# Altium schematic sheet Power-Tree-Main.SchDoc
size A3; DocumentNumber: 4-; SheetNumber: 4; SheetTotal: 7
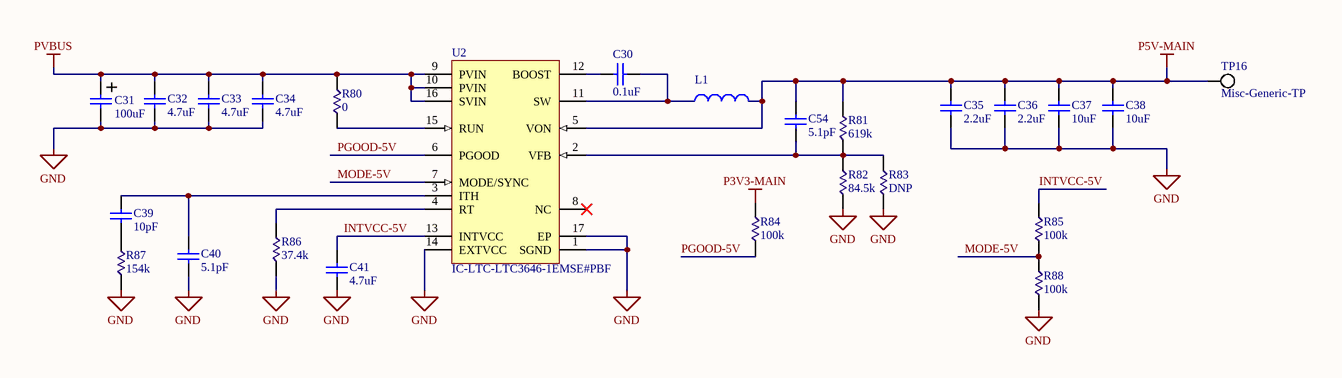
[diagram p0: Power-Tree-Main.SchDoc]

## Parts
C30  value 0.1uF  [FOOTPRINT-0805-GEN]  (hidden comment: Capacitor-Generic-0805)
C31  value 100uF  [FOOTPRINT-NIPPON-JA0]  (hidden comment: Capacitor-Nippon-HHXC350ARA470MF80G)
C32  value 4.7uF  [FOOTPRINT-1206-GEN]  (hidden comment: C1206C475K5RACAUTO)
C33  value 4.7uF  [FOOTPRINT-1206-GEN]  (hidden comment: C1206C475K5RACAUTO)
C34  value 4.7uF  [FOOTPRINT-1206-GEN]  (hidden comment: C1206C475K5RACAUTO)
C35  value 2.2uF  [FOOTPRINT-0805-GEN]  (hidden comment: C0805C225K8PAC)
C36  value 2.2uF  [FOOTPRINT-0805-GEN]  (hidden comment: C0805C225K8PAC)
C37  value 10uF  [FOOTPRINT-0805-GEN]  (hidden comment: C0805C106K8PAC)
C38  value 10uF  [FOOTPRINT-0805-GEN]  (hidden comment: C0805C106K8PAC)
C39  value 10pF  [FOOTPRINT-0805-GEN]  (hidden comment: C0805C100J3HACTU)
C40  value 5.1pF  [FOOTPRINT-0805-GEN]  (hidden comment: C0805C519K5GACTU)
C41  value 4.7uF  [FOOTPRINT-0805-GEN]  (hidden comment: C0805C475K8PAC)
C54  value 5.1pF  [FOOTPRINT-0805-GEN]  (hidden comment: C0805C519K5GACTU)
L1  Inductor-Bourns-SRP7050TA-2R2M  [FOOTPRINT-BOURNS-SRP7050TA]  (value not drawn)
R80  value 0  [FOOTPRINT-0805-GEN]  (hidden comment: SMC)
R81  value 619k  [FOOTPRINT-0805-GEN]  (hidden comment: SMC)
R82  value 84.5k  [FOOTPRINT-0805-GEN]  (hidden comment: SMC)
R83  value DNP  [FOOTPRINT-0805-GEN]  (hidden comment: Trim, 0 ohm)
R84  value 100k  [FOOTPRINT-0805-GEN]  (hidden comment: SMC)
R85  value 100k  [FOOTPRINT-0805-GEN]  (hidden comment: SMC)
R86  value 37.4k  [FOOTPRINT-0805-GEN]  (hidden comment: SMC)
R87  value 154k  [FOOTPRINT-0805-GEN]  (hidden comment: SMC)
R88  value 100k  [FOOTPRINT-0805-GEN]  (hidden comment: SMC)
TP16  Misc-Generic-TP  [FOOTPRINT-GENERIC-TP-VIA-1MM5]
U2  IC-LTC-LTC3646-1EMSE#PBF  [FOOTPRINT-LTC-LTC3646]

## Nets
GND: C31.2 C32.1 C33.1 C34.1 C35.2 C36.2 C37.1 C38.1 C40.1 C41.1 R82.2 R83.2 R86.1 R87.1 R88.1 U2.1(SGND) U2.14(EXTVCC) U2.17(EP)
P3V3-MAIN: R84.2
P5V-MAIN: C35.1 C36.1 C37.2 C38.2 C54.2 L1.2 R81.2 TP16.1(TP) U2.5(VON)
PVBUS: C31.1 C32.2 C33.2 C34.2 R80.1 U2.9(PVIN) U2.10(PVIN) U2.16(SVIN)
INTVCC-5V: C41.2 R85.2 U2.13(INTVCC)
MODE-5V: R85.1 R88.2 U2.7(MODE/SYNC)
PGOOD-5V: R84.1 U2.6(PGOOD)
NetC30_1: C30.1 L1.1 U2.11(SW)
NetC30_2: C30.2 U2.12(BOOST)
NetC39_1: C39.1 R87.2
NetC39_2: C39.2 C40.2 U2.3(ITH)
NetC54_1: C54.1 R81.1 R82.1 R83.1 U2.2(VFB)
NetR80_2: R80.2 U2.15(RUN)
NetR86_2: R86.2 U2.4(RT)

Not connected (* = marked no-connect by the designer): U2 8(NC)*

## Notes on the sheet
- Title
- Size:
- Date:
- Engineer
- A3
- Number:
- Sheet
- of
- Approved
- Revision:
- UC Riverside
- www.highlanderracing.org <http://www.highlanderracing.org>
- File:
- (in symbol Capacitor-Nippon-HHXC350ARA470MF80G) +

## Library data of the parts
C30 C40 C54 = Capacitor-Generic-0805: Capacitor; Published: 8-Jun-2000; LatestRevisionDate: 17-Jul-2002; LatestRevisionNote: Re-released for DXP Platform.; PackageReference: RAD-0.3; Publisher: Altium Limited; PackageDescription: Radial Cap, Thru-Hole; 2 Leads; 0.3 in Pin Spacing
C31 = Capacitor-Nippon-HHXC350ARA470MF80G: CAP ALUM POLY 100UF 20% 50V SMD
C32-C34 = Capacitor-Generic-1206: CAP CER 1206 4.7UF 50V X7R 10%; Published: 8-Jun-2000; LatestRevisionDate: 17-Jul-2002; LatestRevisionNote: Re-released for DXP Platform.; PackageReference: RAD-0.3; Publisher: Altium Limited; PackageDescription: Radial Cap, Thru-Hole; 2 Leads; 0.3 in Pin Spacing
C35 C36 = Capacitor-Generic-0805: CAP CER 2.2UF 10V X5R 0805; Published: 8-Jun-2000; LatestRevisionDate: 17-Jul-2002; LatestRevisionNote: Re-released for DXP Platform.; PackageReference: RAD-0.3; Publisher: Altium Limited; PackageDescription: Radial Cap, Thru-Hole; 2 Leads; 0.3 in Pin Spacing
C37 C38 = Capacitor-Generic-0805: CAP CER 10UF 10V X5R 0805; Published: 8-Jun-2000; LatestRevisionDate: 17-Jul-2002; LatestRevisionNote: Re-released for DXP Platform.; PackageReference: RAD-0.3; Publisher: Altium Limited; PackageDescription: Radial Cap, Thru-Hole; 2 Leads; 0.3 in Pin Spacing
C39 = Capacitor-Generic-0805: CAP CER 0805 10PF 25V ULTRA STAB; Published: 8-Jun-2000; LatestRevisionDate: 17-Jul-2002; LatestRevisionNote: Re-released for DXP Platform.; PackageReference: RAD-0.3; Publisher: Altium Limited; PackageDescription: Radial Cap, Thru-Hole; 2 Leads; 0.3 in Pin Spacing
C41 = Capacitor-Generic-0805: CAP CER 4.7UF 10V X5R 0805; Published: 8-Jun-2000; LatestRevisionDate: 17-Jul-2002; LatestRevisionNote: Re-released for DXP Platform.; PackageReference: RAD-0.3; Publisher: Altium Limited; PackageDescription: Radial Cap, Thru-Hole; 2 Leads; 0.3 in Pin Spacing
L1 = Inductor-Bourns-SRP7050TA-2R2M: FIXED IND 2.2UH 10A 12 MOHM SMD
R80-R88 = Resistor-Generic-0805-2012: 1/8 Watt Surface Mount Resistor
U2 = IC-LTC-LTC3646-1EMSE#PBF: 1 A Synchronous Step-Down Converter, 16-pin SOP (MSE-16-EDP), -40 to 85 degC, Pb-Free; PartNumber: LTC3646EMSE#PBF; Manufacturer: Linear Technology; Number of Outputs: 1; Frequency Adjust Range: 200kHz - 3MHz; ComponentLink3Description: Package Specification; PackageReference: MSE-16; ComponentLink2URL: http://cds.linear.com/docs/en/datasheet/36461fa.pdf; ComponentLink1Description: Manufacturer URL; RoHS: TRUE; ComponentLink3URL: http://cds.linear.com/docs/en/packaging/05081667_F_MSE16.pdf; PackageVersion: Rev. F, 05/2013; Mounting Technology: Surface Mount; ComponentLink1URL: http://www.linear.com/; ComponentLink2Description: Datasheet; PackageDescription: 16-Pin Plastic MSOP, Exposed Die Pad, Body 4.039 x 3 mm, Pitch 0.5 mm